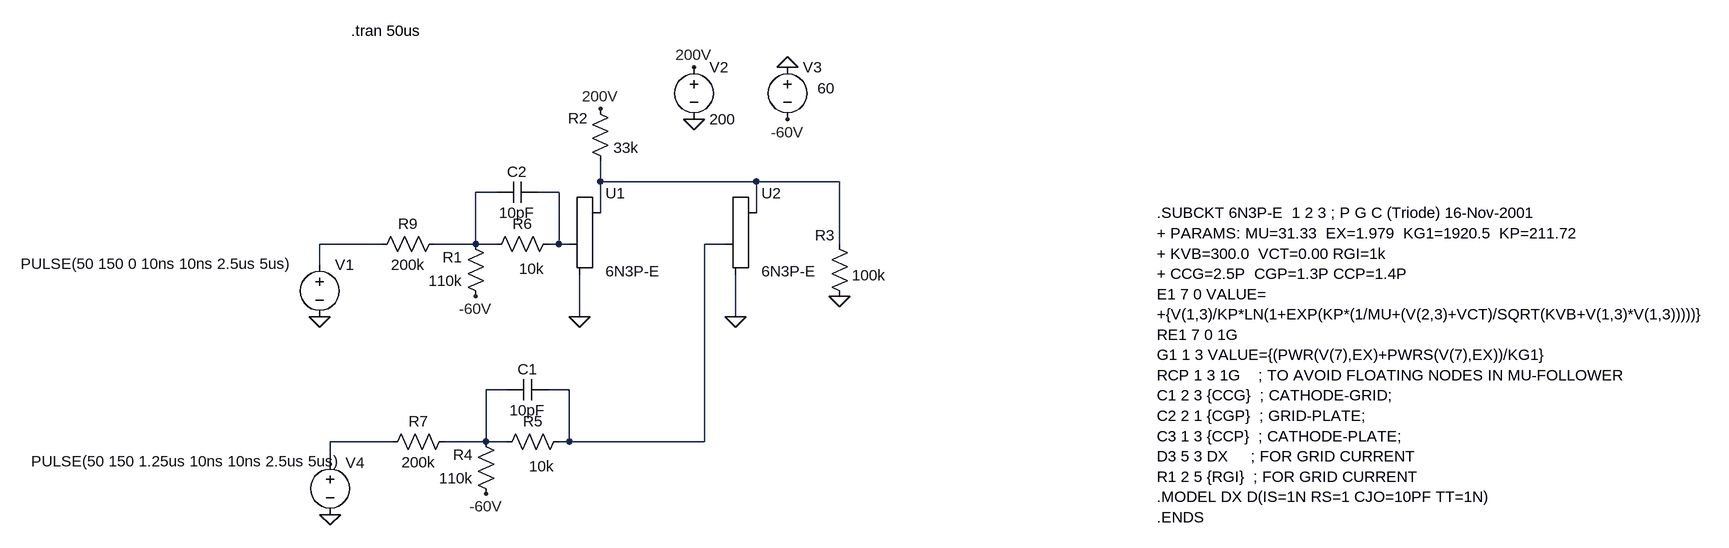
[diagram p0: schematic 2NOR.asc]
2NOR.asc, the LTspice schematic file:
Version 4
SHEET 1 2516 760
WIRE 176 80 176 48
WIRE 416 80 176 80
WIRE 544 80 416 80
WIRE 16 96 -16 96
WIRE 112 96 80 96
WIRE 176 128 176 80
WIRE 416 128 416 80
WIRE -160 176 -256 176
WIRE -16 176 -16 96
WIRE -16 176 -80 176
WIRE 16 176 -16 176
WIRE 112 176 112 96
WIRE 112 176 96 176
WIRE 128 176 112 176
WIRE 368 176 336 176
WIRE 544 176 544 80
WIRE -256 208 -256 176
WIRE 144 288 144 224
WIRE 384 288 384 224
WIRE 32 400 0 400
WIRE 128 400 96 400
WIRE -144 480 -240 480
WIRE 0 480 0 400
WIRE 0 480 -64 480
WIRE 32 480 0 480
WIRE 128 480 128 400
WIRE 128 480 112 480
WIRE 336 480 336 176
WIRE 336 480 128 480
WIRE -240 512 -240 480
FLAG 144 288 0
FLAG -256 288 0
FLAG 320 -16 0
FLAG 544 256 0
FLAG 464 -96 0
FLAG 464 -16 -60V
FLAG -16 256 -60V
FLAG 384 288 0
FLAG 176 -32 200V
FLAG 320 -96 200V
FLAG -240 592 0
FLAG 0 560 -60V
SYMBOL Misc\\triode 176 176 R0
SYMATTR InstName U1
SYMATTR Value 6N3P-E
SYMBOL voltage -256 192 R0
WINDOW 3 -460 14 Left 2
WINDOW 123 0 0 Left 0
WINDOW 39 -177 50 Left 2
SYMATTR Value PULSE(50 150 0 10ns 10ns 2.5us 5us)
SYMATTR InstName V1
SYMBOL voltage 320 -112 R0
WINDOW 123 0 0 Left 0
WINDOW 39 0 0 Left 0
SYMATTR InstName V2
SYMATTR Value 200
SYMBOL res 160 -48 R0
WINDOW 0 -34 30 Left 2
SYMATTR InstName R2
SYMATTR Value 33k
SYMBOL res 528 160 R0
WINDOW 0 -22 2 Left 2
WINDOW 3 35 64 Left 2
SYMATTR InstName R3
SYMATTR Value 100k
SYMBOL voltage 464 -112 R0
WINDOW 3 46 48 Left 2
WINDOW 123 0 0 Left 0
WINDOW 39 0 0 Left 0
SYMATTR Value 60
SYMATTR InstName V3
SYMBOL Misc\\triode 416 176 R0
SYMATTR InstName U2
SYMATTR Value 6N3P-E
SYMBOL res 0 272 R180
WINDOW 0 36 76 Left 2
WINDOW 3 36 40 Left 2
SYMATTR InstName R1
SYMATTR Value 110k
SYMBOL res 112 160 R90
WINDOW 0 0 56 VBottom 2
WINDOW 3 38 42 VTop 2
SYMATTR InstName R6
SYMATTR Value 10k
SYMBOL res -64 160 R90
WINDOW 0 0 56 VBottom 2
WINDOW 3 32 56 VTop 2
SYMATTR InstName R9
SYMATTR Value 200k
SYMBOL cap 80 80 R90
WINDOW 0 0 32 VBottom 2
WINDOW 3 32 32 VTop 2
SYMATTR InstName C2
SYMATTR Value 10pF
SYMBOL voltage -240 496 R0
WINDOW 3 -460 14 Left 2
WINDOW 123 0 0 Left 0
WINDOW 39 -162 47 Left 2
SYMATTR Value PULSE(50 150 1.25us 10ns 10ns 2.5us 5us)
SYMATTR InstName V4
SYMBOL res 16 576 R180
WINDOW 0 36 76 Left 2
WINDOW 3 36 40 Left 2
SYMATTR InstName R4
SYMATTR Value 110k
SYMBOL res 128 464 R90
WINDOW 0 0 56 VBottom 2
WINDOW 3 38 42 VTop 2
SYMATTR InstName R5
SYMATTR Value 10k
SYMBOL res -48 464 R90
WINDOW 0 0 56 VBottom 2
WINDOW 3 32 56 VTop 2
SYMATTR InstName R7
SYMATTR Value 200k
SYMBOL cap 96 384 R90
WINDOW 0 0 32 VBottom 2
WINDOW 3 32 32 VTop 2
SYMATTR InstName C1
SYMATTR Value 10pF
TEXT 1032 128 Left 2 !.SUBCKT 6N3P-E  1 2 3 ; P G C (Triode) 16-Nov-2001\n+ PARAMS: MU=31.33  EX=1.979  KG1=1920.5  KP=211.72 \n+ KVB=300.0  VCT=0.00 RGI=1k\n+ CCG=2.5P  CGP=1.3P CCP=1.4P\nE1 7 0 VALUE=\n+{V(1,3)/KP*LN(1+EXP(KP*(1/MU+(V(2,3)+VCT)/SQRT(KVB+V(1,3)*V(1,3)))))}\nRE1 7 0 1G\nG1 1 3 VALUE={(PWR(V(7),EX)+PWRS(V(7),EX))/KG1}\nRCP 1 3 1G    ; TO AVOID FLOATING NODES IN MU-FOLLOWER\nC1 2 3 {CCG}  ; CATHODE-GRID; \nC2 2 1 {CGP}  ; GRID-PLATE; \nC3 1 3 {CCP}  ; CATHODE-PLATE; \nD3 5 3 DX     ; FOR GRID CURRENT\nR1 2 5 {RGI}  ; FOR GRID CURRENT\n.MODEL DX D(IS=1N RS=1 CJO=10PF TT=1N)\n.ENDS
TEXT -208 -152 Left 2 !.tran 50us

The netlist it stands for:
* 2NOR.asc
XU1 N001 N003 0 6N3P-E
V1 N004 0 PULSE(50 150 0 10ns 10ns 2.5us 5us)
V2 200V 0 200
R2 200V N001 33k
R3 N001 0 100k
V3 0 -60V 60
XU2 N001 N005 0 6N3P-E
R1 -60V N002 110k
R6 N003 N002 10k
R9 N002 N004 200k
C2 N003 N002 10pF
V4 N007 0 PULSE(50 150 1.25us 10ns 10ns 2.5us 5us)
R4 -60V N006 110k
R5 N005 N006 10k
R7 N006 N007 200k
C1 N005 N006 10pF
.SUBCKT 6N3P-E  1 2 3 ; P G C (Triode) 16-Nov-2001
+ PARAMS: MU=31.33  EX=1.979  KG1=1920.5  KP=211.72
+ KVB=300.0  VCT=0.00 RGI=1k
+ CCG=2.5P  CGP=1.3P CCP=1.4P
E1 7 0 VALUE=
+{V(1,3)/KP*LN(1+EXP(KP*(1/MU+(V(2,3)+VCT)/SQRT(KVB+V(1,3)*V(1,3)))))}
RE1 7 0 1G
G1 1 3 VALUE={(PWR(V(7),EX)+PWRS(V(7),EX))/KG1}
RCP 1 3 1G    ; TO AVOID FLOATING NODES IN MU-FOLLOWER
C1 2 3 {CCG}  ; CATHODE-GRID;
C2 2 1 {CGP}  ; GRID-PLATE;
C3 1 3 {CCP}  ; CATHODE-PLATE;
D3 5 3 DX     ; FOR GRID CURRENT
R1 2 5 {RGI}  ; FOR GRID CURRENT
.MODEL DX D(IS=1N RS=1 CJO=10PF TT=1N)
.ENDS
.tran 50us
.backanno
.end